# Altium project IMX8SoCIot.PrjPcb (part 8 of 9)

## Sheet ETHERNET.SchDoc
size 594 x 420 mm; SheetNumber: 18; SheetTotal: 20
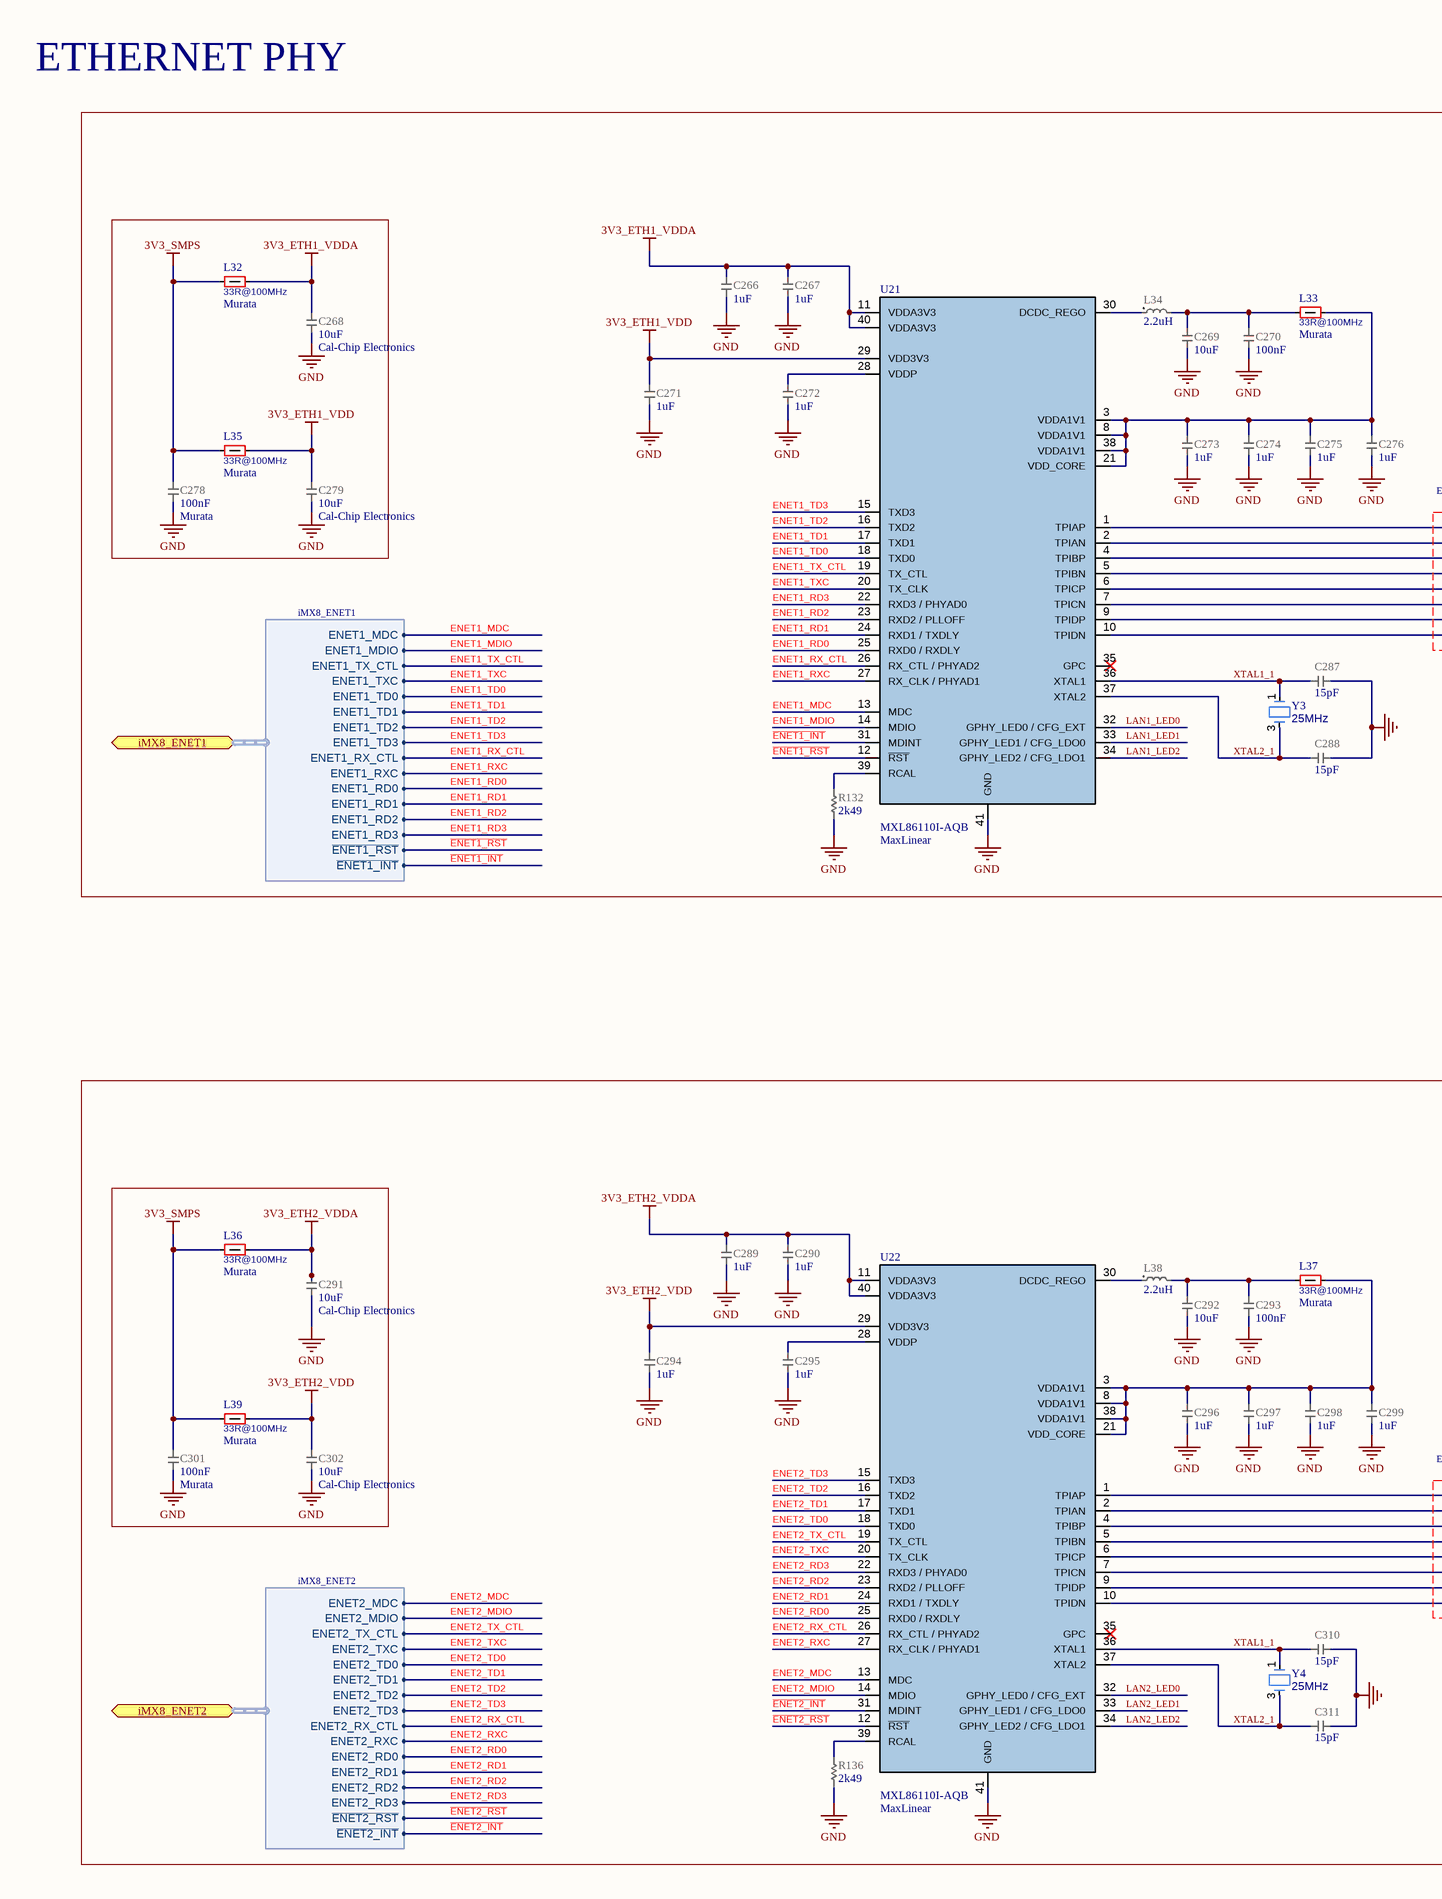
[diagram p29: ETHERNET.SchDoc, left]
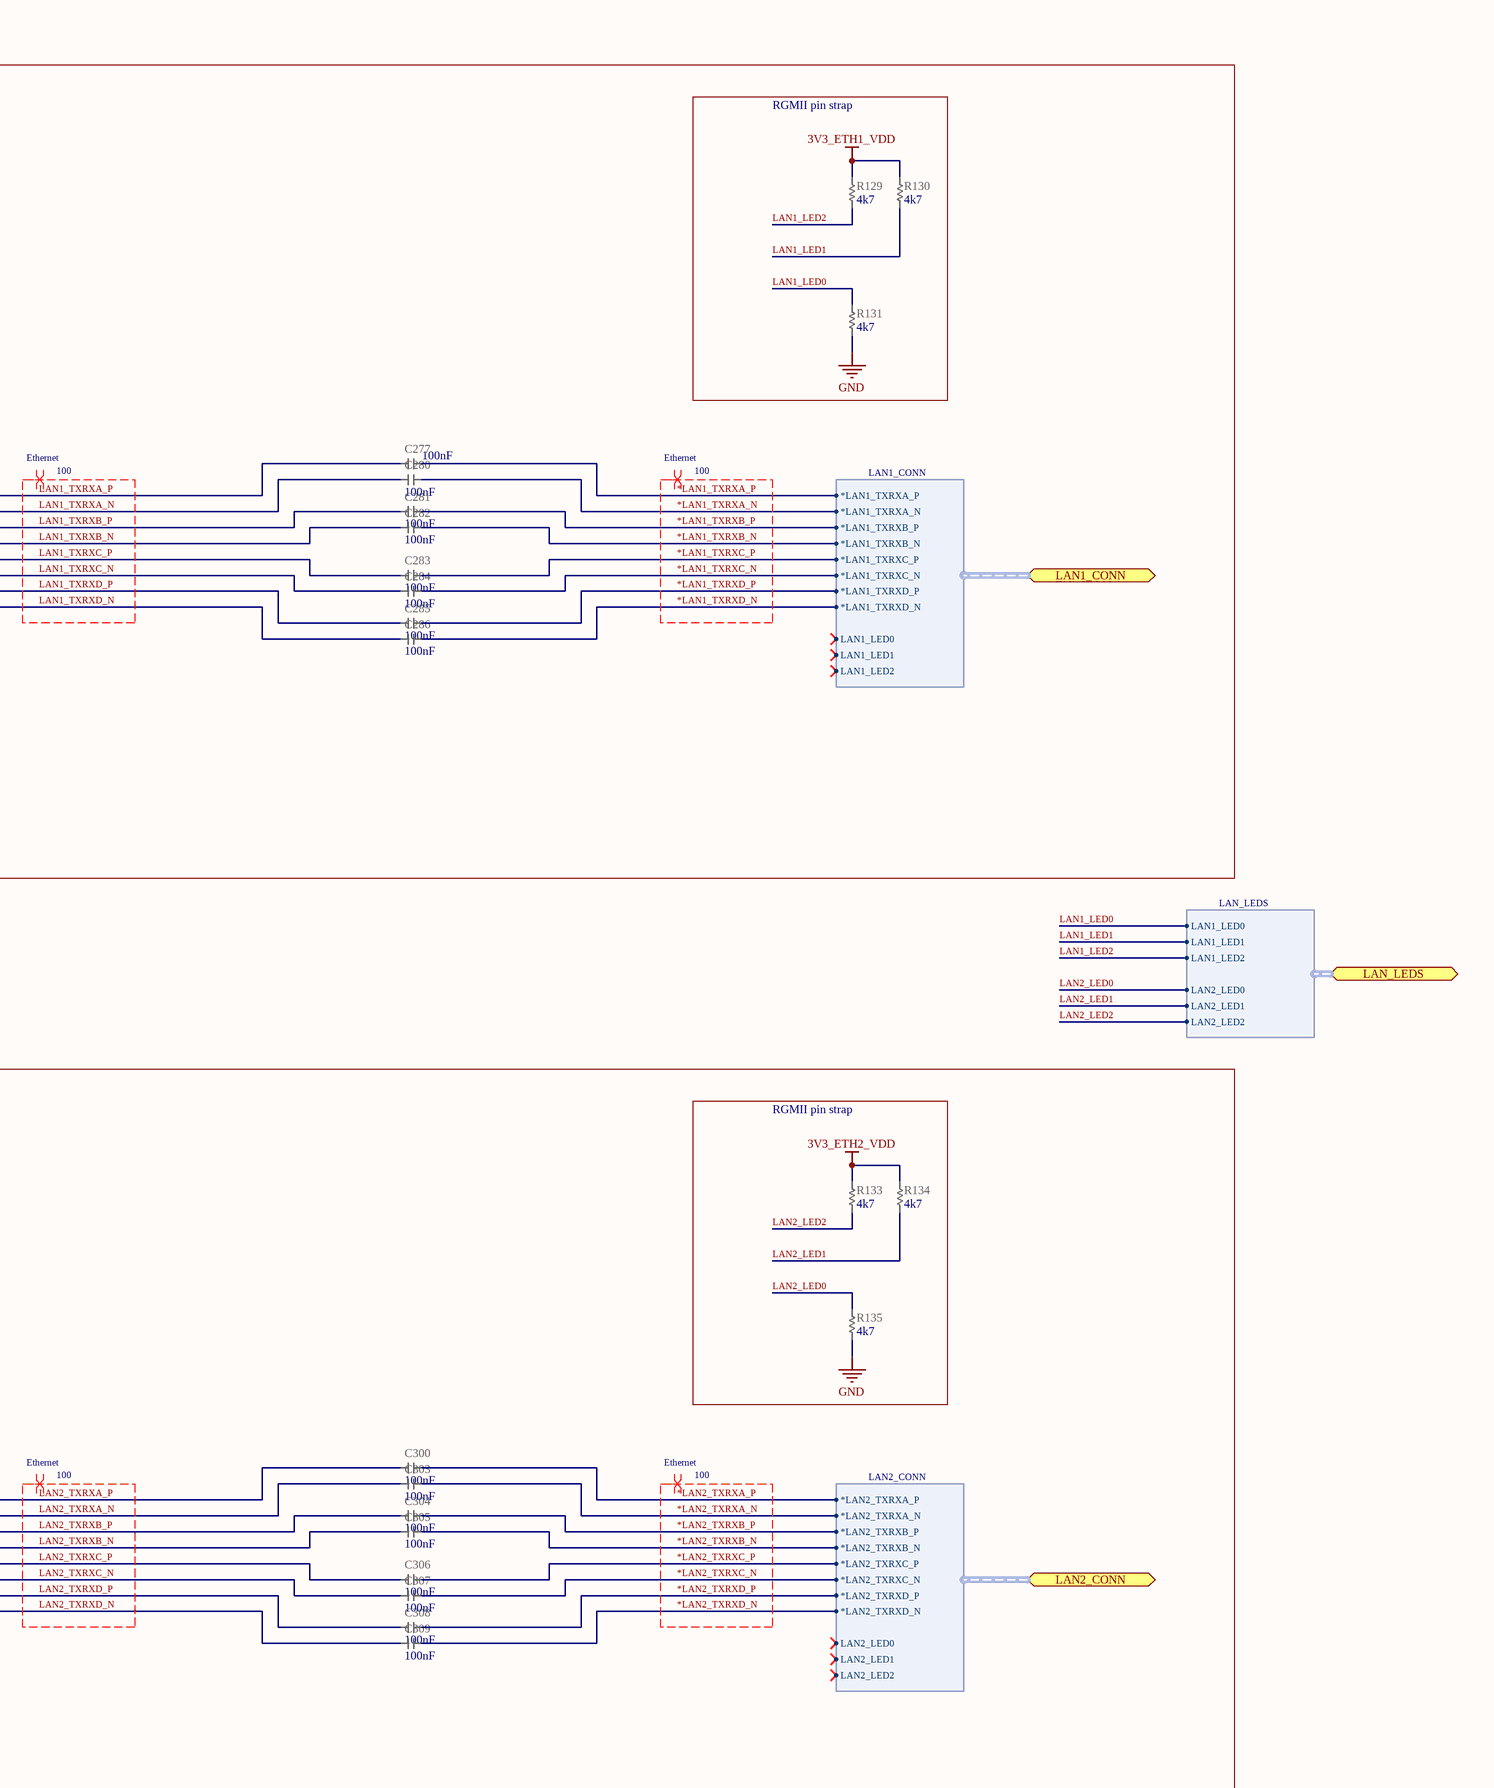
[diagram p30: ETHERNET.SchDoc, right]

### Parts
C266  value 1uF  [CAP_0201_UN1Q]  (hidden comment: CAP_0201_1uF_X6S)
C267  value 1uF  [CAP_0201_UN1Q]  (hidden comment: CAP_0201_1uF_X6S)
C268  value 10uF  Manufacturer: Cal-Chip Electronics  [CAP_0402_H09W07_UN1Q]  (hidden comment: CAP_0402_10u_X6S)
C269  value 10uF  [CAP_0402_H09W07_UN1Q]  (hidden comment: CAP_0402_10u_X6S)
C270  value 100nF  [CAP_0201_UN1Q]  (hidden comment: CAP_0201_100n_X7S_16V)
C271  value 1uF  [CAP_0201_UN1Q]  (hidden comment: CAP_0201_1uF_X6S)
C272  value 1uF  [CAP_0201_UN1Q]  (hidden comment: CAP_0201_1uF_X6S)
C273  value 1uF  [CAP_0201_UN1Q]  (hidden comment: CAP_0201_1uF_X6S)
C274  value 1uF  [CAP_0201_UN1Q]  (hidden comment: CAP_0201_1uF_X6S)
C275  value 1uF  [CAP_0201_UN1Q]  (hidden comment: CAP_0201_1uF_X6S)
C276  value 1uF  [CAP_0201_UN1Q]  (hidden comment: CAP_0201_1uF_X6S)
C277  value 100nF  [CAP_0201_UN1Q]  (hidden comment: CAP_0201_100n_X7S_16V)
C278  value 100nF  Manufacturer: Murata  [CAP_0201_UN1Q]  (hidden comment: CAP_0201_100n_X7S_16V)
C279  value 10uF  Manufacturer: Cal-Chip Electronics  [CAP_0402_H09W07_UN1Q]  (hidden comment: CAP_0402_10u_X6S)
C280  value 100nF  [CAP_0201_UN1Q]  (hidden comment: CAP_0201_100n_X7S_16V)
C281  value 100nF  [CAP_0201_UN1Q]  (hidden comment: CAP_0201_100n_X7S_16V)
C282  value 100nF  [CAP_0201_UN1Q]  (hidden comment: CAP_0201_100n_X7S_16V)
C283  value 100nF  [CAP_0201_UN1Q]  (hidden comment: CAP_0201_100n_X7S_16V)
C284  value 100nF  [CAP_0201_UN1Q]  (hidden comment: CAP_0201_100n_X7S_16V)
C285  value 100nF  [CAP_0201_UN1Q]  (hidden comment: CAP_0201_100n_X7S_16V)
C286  value 100nF  [CAP_0201_UN1Q]  (hidden comment: CAP_0201_100n_X7S_16V)
C287  value 15pF  [CAP_0201_UN1Q]  (hidden comment: CAP_0201_15p)
C288  value 15pF  [CAP_0201_UN1Q]  (hidden comment: CAP_0201_15p)
C289  value 1uF  [CAP_0201_UN1Q]  (hidden comment: CAP_0201_1uF_X6S)
C290  value 1uF  [CAP_0201_UN1Q]  (hidden comment: CAP_0201_1uF_X6S)
C291  value 10uF  Manufacturer: Cal-Chip Electronics  [CAP_0402_H09W07_UN1Q]  (hidden comment: CAP_0402_10u_X6S)
C292  value 10uF  [CAP_0402_H09W07_UN1Q]  (hidden comment: CAP_0402_10u_X6S)
C293  value 100nF  [CAP_0201_UN1Q]  (hidden comment: CAP_0201_100n_X7S_16V)
C294  value 1uF  [CAP_0201_UN1Q]  (hidden comment: CAP_0201_1uF_X6S)
C295  value 1uF  [CAP_0201_UN1Q]  (hidden comment: CAP_0201_1uF_X6S)
C296  value 1uF  [CAP_0201_UN1Q]  (hidden comment: CAP_0201_1uF_X6S)
C297  value 1uF  [CAP_0201_UN1Q]  (hidden comment: CAP_0201_1uF_X6S)
C298  value 1uF  [CAP_0201_UN1Q]  (hidden comment: CAP_0201_1uF_X6S)
C299  value 1uF  [CAP_0201_UN1Q]  (hidden comment: CAP_0201_1uF_X6S)
C300  value 100nF  [CAP_0201_UN1Q]  (hidden comment: CAP_0201_100n_X7S_16V)
C301  value 100nF  Manufacturer: Murata  [CAP_0201_UN1Q]  (hidden comment: CAP_0201_100n_X7S_16V)
C302  value 10uF  Manufacturer: Cal-Chip Electronics  [CAP_0402_H09W07_UN1Q]  (hidden comment: CAP_0402_10u_X6S)
C303  value 100nF  [CAP_0201_UN1Q]  (hidden comment: CAP_0201_100n_X7S_16V)
C304  value 100nF  [CAP_0201_UN1Q]  (hidden comment: CAP_0201_100n_X7S_16V)
C305  value 100nF  [CAP_0201_UN1Q]  (hidden comment: CAP_0201_100n_X7S_16V)
C306  value 100nF  [CAP_0201_UN1Q]  (hidden comment: CAP_0201_100n_X7S_16V)
C307  value 100nF  [CAP_0201_UN1Q]  (hidden comment: CAP_0201_100n_X7S_16V)
C308  value 100nF  [CAP_0201_UN1Q]  (hidden comment: CAP_0201_100n_X7S_16V)
C309  value 100nF  [CAP_0201_UN1Q]  (hidden comment: CAP_0201_100n_X7S_16V)
C310  value 15pF  [CAP_0201_UN1Q]  (hidden comment: CAP_0201_15p)
C311  value 15pF  [CAP_0201_UN1Q]  (hidden comment: CAP_0201_15p)
L32  value 33R@100MHz  Manufacturer: Murata  [IND_0201_UN1Q]  (hidden comment: FERRITE_0201_BLM03_33Ohm)
L33  value 33R@100MHz  Manufacturer: Murata  [IND_0201_UN1Q]  (hidden comment: FERRITE_0201_BLM03_33Ohm)
L34  value 2.2uH  [IND_74479335329222_353220]  (hidden comment: IND_74479335329222_2u2)
L35  value 33R@100MHz  Manufacturer: Murata  [IND_0201_UN1Q]  (hidden comment: FERRITE_0201_BLM03_33Ohm)
L36  value 33R@100MHz  Manufacturer: Murata  [IND_0201_UN1Q]  (hidden comment: FERRITE_0201_BLM03_33Ohm)
L37  value 33R@100MHz  Manufacturer: Murata  [IND_0201_UN1Q]  (hidden comment: FERRITE_0201_BLM03_33Ohm)
L38  value 2.2uH  [IND_74479335329222_353220]  (hidden comment: IND_74479335329222_2u2)
L39  value 33R@100MHz  Manufacturer: Murata  [IND_0201_UN1Q]  (hidden comment: FERRITE_0201_BLM03_33Ohm)
R129  value 4k7  [RES_0201_UN1Q]  (hidden comment: RES_0201_4k7)
R130  value 4k7  [RES_0201_UN1Q]  (hidden comment: RES_0201_4k7)
R131  value 4k7  [RES_0201_UN1Q]  (hidden comment: RES_0201_4k7)
R132  value 2k49  [RES_0201_UN1Q]  (hidden comment: RES_0201_2k49)
R133  value 4k7  [RES_0201_UN1Q]  (hidden comment: RES_0201_4k7)
R134  value 4k7  [RES_0201_UN1Q]  (hidden comment: RES_0201_4k7)
R135  value 4k7  [RES_0201_UN1Q]  (hidden comment: RES_0201_4k7)
R136  value 2k49  [RES_0201_UN1Q]  (hidden comment: RES_0201_2k49)
U21  Manufacturer: MaxLinear  [QFN40_5x5mm]  (hidden comment: MXL86110I-AQB)
U22  Manufacturer: MaxLinear  [QFN40_5x5mm]  (hidden comment: MXL86110I-AQB)
Y3  value 25MHz  [XTAL_2016_UN1Q]  (hidden comment: XTAL_25M_ECS_2016_4-SMD)
Y4  value 25MHz  [XTAL_2016_UN1Q]  (hidden comment: XTAL_25M_ECS_2016_4-SMD)

### Blocks framed on the sheet
RGMII pin strap: R129-R131
RGMII pin strap: R133-R135

### Ports
iMX8_ENET1 (bidir, harness iMX8_ENET1), iMX8_ENET2 (bidir, harness iMX8_ENET2), LAN1_CONN (bidir, harness LAN1_CONN), LAN2_CONN (bidir, harness LAN2_CONN), LAN_LEDS (bidir, harness LAN_LEDS)

### Harnesses
iMX8_ENET1: ENET1_MDC, ENET1_MDIO, ENET1_TX_CTL, ENET1_TXC, ENET1_TD0, ENET1_TD1, ENET1_TD2, ENET1_TD3, ENET1_RX_CTL, ENET1_RXC, ENET1_RD0, ENET1_RD1, ENET1_RD2, ENET1_RD3, ~{ENET1_RST}, ~{ENET1_INT}
iMX8_ENET2: ENET2_MDC, ENET2_MDIO, ENET2_TX_CTL, ENET2_TXC, ENET2_TD0, ENET2_TD1, ENET2_TD2, ENET2_TD3, ENET2_RX_CTL, ENET2_RXC, ENET2_RD0, ENET2_RD1, ENET2_RD2, ENET2_RD3, ~{ENET2_RST}, ~{ENET2_INT}
LAN1_CONN: LAN1_LED0, LAN1_LED1, LAN1_LED2, *LAN1_TXRXA_P, *LAN1_TXRXA_N, *LAN1_TXRXB_P, *LAN1_TXRXB_N, *LAN1_TXRXC_P, *LAN1_TXRXC_N, *LAN1_TXRXD_P, *LAN1_TXRXD_N
LAN2_CONN: LAN2_LED0, LAN2_LED1, LAN2_LED2, *LAN2_TXRXA_P, *LAN2_TXRXA_N, *LAN2_TXRXB_P, *LAN2_TXRXB_N, *LAN2_TXRXC_P, *LAN2_TXRXC_N, *LAN2_TXRXD_P, *LAN2_TXRXD_N
LAN_LEDS: LAN1_LED0, LAN1_LED1, LAN1_LED2, LAN2_LED0, LAN2_LED1, LAN2_LED2

### Nets
3V3_ETH1_VDD: C271.2 C279.2 L35.2 R129.2 R130.2 U21.29(VDD3V3)
3V3_ETH1_VDDA: C266.2 C267.2 C268.2 L32.2 U21.11(VDDA3V3) U21.40(VDDA3V3)
3V3_ETH2_VDD: C294.2 C302.2 L39.2 R133.2 R134.2 U22.29(VDD3V3)
3V3_ETH2_VDDA: C289.2 C290.2 C291.2 L36.2 U22.11(VDDA3V3) U22.40(VDDA3V3)
3V3_SMPS: C278.2 C301.2 L32.1 L35.1 L36.1 L39.1
GND: C266.1 C267.1 C268.1 C269.2 C270.1 C271.1 C272.1 C273.1 C274.1 C275.1 C276.1 C278.1 C279.1 C287.2 C288.2 C289.1 C290.1 C291.1 C292.2 C293.1 C294.1 C295.1 C296.1 C297.1 C298.1 C299.1 C301.1 C302.1 C310.2 C311.2 R131.1 R132.1 R135.1 R136.1 U21.41(GND) U22.41(GND) Y3.2(GND) Y3.4(GND) Y4.2(GND) Y4.4(GND)
*LAN1_TXRXA_N: C280.2 ; port LAN1_CONN.*LAN1_TXRXA_N
*LAN1_TXRXA_P: C277.2 ; port LAN1_CONN.*LAN1_TXRXA_P
*LAN1_TXRXB_N: C282.2 ; port LAN1_CONN.*LAN1_TXRXB_N
*LAN1_TXRXB_P: C281.2 ; port LAN1_CONN.*LAN1_TXRXB_P
*LAN1_TXRXC_N: C284.2 ; port LAN1_CONN.*LAN1_TXRXC_N
*LAN1_TXRXC_P: C283.2 ; port LAN1_CONN.*LAN1_TXRXC_P
*LAN1_TXRXD_N: C286.2 ; port LAN1_CONN.*LAN1_TXRXD_N
*LAN1_TXRXD_P: C285.2 ; port LAN1_CONN.*LAN1_TXRXD_P
*LAN2_TXRXA_N: C303.2 ; port LAN2_CONN.*LAN2_TXRXA_N
*LAN2_TXRXA_P: C300.2 ; port LAN2_CONN.*LAN2_TXRXA_P
*LAN2_TXRXB_N: C305.2 ; port LAN2_CONN.*LAN2_TXRXB_N
*LAN2_TXRXB_P: C304.2 ; port LAN2_CONN.*LAN2_TXRXB_P
*LAN2_TXRXC_N: C307.2 ; port LAN2_CONN.*LAN2_TXRXC_N
*LAN2_TXRXC_P: C306.2 ; port LAN2_CONN.*LAN2_TXRXC_P
*LAN2_TXRXD_N: C309.2 ; port LAN2_CONN.*LAN2_TXRXD_N
*LAN2_TXRXD_P: C308.2 ; port LAN2_CONN.*LAN2_TXRXD_P
~{ENET1_INT}: U21.31(MDINT) ; port iMX8_ENET1.~{ENET1_INT}
~{ENET1_RST}: U21.12(~{RST}) ; port iMX8_ENET1.~{ENET1_RST}
~{ENET2_INT}: U22.31(MDINT) ; port iMX8_ENET2.~{ENET2_INT}
~{ENET2_RST}: U22.12(~{RST}) ; port iMX8_ENET2.~{ENET2_RST}
ENET1_MDC: U21.13(MDC) ; port iMX8_ENET1.ENET1_MDC
ENET1_MDIO: U21.14(MDIO) ; port iMX8_ENET1.ENET1_MDIO
ENET1_RD0: U21.25(RXD0_/_RXDLY) ; port iMX8_ENET1.ENET1_RD0
ENET1_RD1: U21.24(RXD1_/_TXDLY) ; port iMX8_ENET1.ENET1_RD1
ENET1_RD2: U21.23(RXD2_/_PLLOFF) ; port iMX8_ENET1.ENET1_RD2
ENET1_RD3: U21.22(RXD3_/_PHYAD0) ; port iMX8_ENET1.ENET1_RD3
ENET1_RX_CTL: U21.26(RX_CTL_/_PHYAD2) ; port iMX8_ENET1.ENET1_RX_CTL
ENET1_RXC: U21.27(RX_CLK_/_PHYAD1) ; port iMX8_ENET1.ENET1_RXC
ENET1_TD0: U21.18(TXD0) ; port iMX8_ENET1.ENET1_TD0
ENET1_TD1: U21.17(TXD1) ; port iMX8_ENET1.ENET1_TD1
ENET1_TD2: U21.16(TXD2) ; port iMX8_ENET1.ENET1_TD2
ENET1_TD3: U21.15(TXD3) ; port iMX8_ENET1.ENET1_TD3
ENET1_TX_CTL: U21.19(TX_CTL) ; port iMX8_ENET1.ENET1_TX_CTL
ENET1_TXC: U21.20(TX_CLK) ; port iMX8_ENET1.ENET1_TXC
ENET2_MDC: U22.13(MDC) ; port iMX8_ENET2.ENET2_MDC
ENET2_MDIO: U22.14(MDIO) ; port iMX8_ENET2.ENET2_MDIO
ENET2_RD0: U22.25(RXD0_/_RXDLY) ; port iMX8_ENET2.ENET2_RD0
ENET2_RD1: U22.24(RXD1_/_TXDLY) ; port iMX8_ENET2.ENET2_RD1
ENET2_RD2: U22.23(RXD2_/_PLLOFF) ; port iMX8_ENET2.ENET2_RD2
ENET2_RD3: U22.22(RXD3_/_PHYAD0) ; port iMX8_ENET2.ENET2_RD3
ENET2_RX_CTL: U22.26(RX_CTL_/_PHYAD2) ; port iMX8_ENET2.ENET2_RX_CTL
ENET2_RXC: U22.27(RX_CLK_/_PHYAD1) ; port iMX8_ENET2.ENET2_RXC
ENET2_TD0: U22.18(TXD0) ; port iMX8_ENET2.ENET2_TD0
ENET2_TD1: U22.17(TXD1) ; port iMX8_ENET2.ENET2_TD1
ENET2_TD2: U22.16(TXD2) ; port iMX8_ENET2.ENET2_TD2
ENET2_TD3: U22.15(TXD3) ; port iMX8_ENET2.ENET2_TD3
ENET2_TX_CTL: U22.19(TX_CTL) ; port iMX8_ENET2.ENET2_TX_CTL
ENET2_TXC: U22.20(TX_CLK) ; port iMX8_ENET2.ENET2_TXC
LAN1_LED0: R131.2 U21.32(GPHY_LED0_/_CFG_EXT) ; port LAN_LEDS.LAN1_LED0
LAN1_LED1: R130.1 U21.33(GPHY_LED1_/_CFG_LDO0) ; port LAN_LEDS.LAN1_LED1
LAN1_LED2: R129.1 U21.34(GPHY_LED2_/_CFG_LDO1) ; port LAN_LEDS.LAN1_LED2
LAN1_TXRXA_N: C280.1 U21.2(TPIAN)
LAN1_TXRXA_P: C277.1 U21.1(TPIAP)
LAN1_TXRXB_N: C282.1 U21.5(TPIBN)
LAN1_TXRXB_P: C281.1 U21.4(TPIBP)
LAN1_TXRXC_N: C284.1 U21.7(TPICN)
LAN1_TXRXC_P: C283.1 U21.6(TPICP)
LAN1_TXRXD_N: C286.1 U21.10(TPIDN)
LAN1_TXRXD_P: C285.1 U21.9(TPIDP)
LAN2_LED0: R135.2 U22.32(GPHY_LED0_/_CFG_EXT) ; port LAN_LEDS.LAN2_LED0
LAN2_LED1: R134.1 U22.33(GPHY_LED1_/_CFG_LDO0) ; port LAN_LEDS.LAN2_LED1
LAN2_LED2: R133.1 U22.34(GPHY_LED2_/_CFG_LDO1) ; port LAN_LEDS.LAN2_LED2
LAN2_TXRXA_N: C303.1 U22.2(TPIAN)
LAN2_TXRXA_P: C300.1 U22.1(TPIAP)
LAN2_TXRXB_N: C305.1 U22.5(TPIBN)
LAN2_TXRXB_P: C304.1 U22.4(TPIBP)
LAN2_TXRXC_N: C307.1 U22.7(TPICN)
LAN2_TXRXC_P: C306.1 U22.6(TPICP)
LAN2_TXRXD_N: C309.1 U22.10(TPIDN)
LAN2_TXRXD_P: C308.1 U22.9(TPIDP)
XTAL1_1: C287.1 C310.1 U21.36(XTAL1) U22.36(XTAL1) Y3.1 Y4.1
XTAL2_1: C288.1 C311.1 U21.37(XTAL2) U22.37(XTAL2) Y3.3 Y4.3
NetC269_1: C269.1 C270.2 L33.1 L34.2
NetC272_2: C272.2 U21.28(VDDP)
NetC273_2: C273.2 C274.2 C275.2 C276.2 L33.2 U21.3(VDDA1V1) U21.8(VDDA1V1) U21.21(VDD_CORE) U21.38(VDDA1V1)
NetC292_1: C292.1 C293.2 L37.1 L38.2
NetC295_2: C295.2 U22.28(VDDP)
NetC296_2: C296.2 C297.2 C298.2 C299.2 L37.2 U22.3(VDDA1V1) U22.8(VDDA1V1) U22.21(VDD_CORE) U22.38(VDDA1V1)
NetL34_1: L34.1 U21.30(DCDC_REGO)
NetL38_1: L38.1 U22.30(DCDC_REGO)
NetR132_2: R132.2 U21.39(RCAL)
NetR136_2: R136.2 U22.39(RCAL)

Not connected (* = marked no-connect by the designer): U21 35(GPC)*; U22 35(GPC)*

### Layout directives
differential pair; net class Ethernet; differential pair class 100; rule Matched Net Lengths [Tolerance = 0.4mm]: *LAN1_TXRXA_N, *LAN1_TXRXA_P, *LAN1_TXRXB_N, *LAN1_TXRXB_P, *LAN1_TXRXC_N, *LAN1_TXRXC_P, *LAN1_TXRXD_N, *LAN1_TXRXD_P, *LAN2_TXRXA_N, *LAN2_TXRXA_P, *LAN2_TXRXB_N, *LAN2_TXRXB_P, *LAN2_TXRXC_N, *LAN2_TXRXC_P, *LAN2_TXRXD_N, *LAN2_TXRXD_P, LAN1_TXRXA_N, LAN1_TXRXA_P, LAN1_TXRXB_N, LAN1_TXRXB_P, LAN1_TXRXC_N, LAN1_TXRXC_P, LAN1_TXRXD_N, LAN1_TXRXD_P, LAN2_TXRXA_N, LAN2_TXRXA_P, LAN2_TXRXB_N, LAN2_TXRXB_P, LAN2_TXRXC_N, LAN2_TXRXC_P, LAN2_TXRXD_N, LAN2_TXRXD_P

### Notes on the sheet
- ETHERNET PHY
- DWG NO:
- REV:
- THIS DOCUMENT AND THE DATA DISCLOSED HEREIN OR
- HEREWITH IS THE PROPERTY OF ALTIUM LIMITED AND MAY
- BE FREELY DISTRIBUTED IN WHOLE. NO RIGHTS ARE
- RESERVED OR EXPRESS OR IMPLIED WARANTEE GIVEN.
- REVISION
- DESCRIPTION
- DATE
- APPROVED
- ENG:
- APPROVALS
- PROJECT
- DSN:
- CHK:
- REFERENCE DOCUMENTS
- PROJECT REVISION:
- TITLE
- DOCUMENT REVISION:
- DESIGN ITEM:
- BOM:
- FAB DWG:
- PCB DWG:
- ASSY DWG:
- SCALE:
- A2
- SIZE
- CAGE CODE
- FILE NAME
- DWG NO.
- SHEET
- OF
- REV

### Library data of the parts
C266 C267 C271-C276 C289 C290 C294-C299 = CMP-001-000336-15: as C251 on sheet USB_PER2; Package: 0201; Operating temperature range: -55C to +105C; ComponentLink1Description: 1_Datasheet; ComponentLink2Description: 2_Product page; ComponentLink3Description: 3_X-information; ComponentLink4Description: 4_X-information; Creation date: 20190101; ClassName: SMALL; Source: RLC_UN1Q.SchLib; Manufacturer Part Number: KGM03CS61A105MH; Component Type: Capacitor
C268 C279 C291 C302 = CMP-001-000883-14: CAP; Part Number: GMC04X6S106M6R3NT; Manufacturer: Cal-Chip Electronics, Inc.; Temperature characteristics: X6S; Voltage: 6.3V; Tolerance: +/-20%; Sort order: 304; HasBeenBuilt: TBD; Alternative component: Allowed; System: RLC; Package: 0402; ComponentLink1Description: 1_Datasheet; ComponentLink2Description: 2_Product page; ComponentLink3Description: 3_X-information; ComponentLink4Description: 4_X-information; Creation date: 26042024; Manufacturer Part Number: GMC04X6S106M6R3NT; Component Type: Capacitor
C269 C292 = CMP-001-000883-14: CAP; Part Number: GMC04X6S106M6R3NT; Manufacturer: Cal-Chip Electronics, Inc.; Manufacturer: Cal-Chip Electronics; Temperature characteristics: X6S; Voltage: 6.3V; Tolerance: +/-20%; Sort order: 304; HasBeenBuilt: TBD; Alternative component: Allowed; System: RLC; Package: 0402; ComponentLink1Description: 1_Datasheet; ComponentLink2Description: 2_Product page; ComponentLink3Description: 3_X-information; ComponentLink4Description: 4_X-information; Creation date: 26042024; Manufacturer Part Number: GMC04X6S106M6R3NT; Component Type: Capacitor
C270 C277 C280-C286 C293 C300 C303-C309 = CMP-001-000385-16: as C250 on sheet USB_PER2; Package: 0201; ClassName: SMALL; ComponentLink1Description: 1_Datasheet; ComponentLink2Description: 2_Product page; ComponentLink3Description: 3_X-information; ComponentLink4Description: 4_X-information; Creation date: 20190101; Source: RLC_UN1Q.SchLib; Manufacturer Part Number: GRM033C71C104KE14D; Component Type: Capacitor
C278 C301 = CMP-001-000385-16: CAP; Part Number: GRM033C71C104KE14D; Temperature characteristics: X7S; Tolerance: +/-10%; Sort order: 302; HasBeenBuilt: TBD; Alternative component: Allowed; Voltage: 16V; System: RLC; Package: 0201; ClassName: SMALL; ComponentLink1Description: 1_Datasheet; ComponentLink2Description: 2_Product page; ComponentLink3Description: 3_X-information; ComponentLink4Description: 4_X-information; Creation date: 20190101; Source: RLC_UN1Q.SchLib; Manufacturer Part Number: GRM033C71C104KE14D; Component Type: Capacitor
C287 C288 C310 C311 = CMP-001-000269-15: CAP; Part Number: GRM0335C1H150JA01D; Manufacturer: Murata; Temperature characteristics: C0G; Voltage: 50V; Tolerance: +/-5%; Sort order: 302; HasBeenBuilt: TBD; Alternative component: Allowed; System: RLC; Package: 0201; ComponentLink1Description: 1_Datasheet; ComponentLink2Description: 2_Product page; ComponentLink3Description: 3_X-information; ComponentLink4Description: 4_X-information; Creation date: 20190101; ClassName: SMALL; Source: RLC_UN1Q.SchLib; Manufacturer Part Number: GRM0335C1H150JA01D; Component Type: Capacitor
L32 L33 L35-L37 L39 = CMP-001-000744-8: FERRITE; Part Number: BLM03PG330SN1; Manufacturer Part Number: BLM03PG330SN1D; Tolerance: 25%; Sort order: 362; HasBeenBuilt: TBD; System: Discrete; Current: 750mA; Package: 0201; Operating temperature range: -55 ... +125C; ClassName: SMALL; ComponentLink1Description: 1_Datasheet; ComponentLink1URL: https://www.murata.com/en-us/products/productdetail.aspx?cate=luNoiseSupprFilteChipFerriBead&partno=BLM03PG330SN1%23; ComponentLink2Description: 2_Product page; ComponentLink3Description: 3_X-information; ComponentLink4Description: 4_X-information; Creation date: 20200304; Source: Discrete_UN1Q.SchLib; Component Type: Ferrite
L34 L38 = CMP-001-001617-1: IND, Low DCR, shielded.; Manufacturer: Wurth; Manufacturer: Wurth Elektronik; Manufacturer Part Number: 74439334047; Sort order: 348; System: RLC; Package: 353220; Dimensions WxLxH: 3.5 x 3.2 x 2.0mm; Part Number: 74479335329222; ComponentLink1Description: 1_Datasheet; ComponentLink1URL: https://www.we-online.com/components/products/datasheet/74479335329222.pdf; ComponentLink2Description: 2_Product_page; ComponentLink2URL: https://www.we-online.com/en/components/products/WE-PMFI#74479335329222; Creation date: 20251029; Operating temperature range: -55°C ~ 150°C; ClassName: BIG; ComponentLink3Description: 3_X-information; ComponentLink4Description: 4_X-information; Component Type: Inductor
R129-R131 R133-R135 = CMP-001-000475-13: RES; Part Number: RC0201FR-074K7L; Manufacturer: YAGEO; Manufacturer: Yageo Group; Power Rating: 1/20W; Sort order: 322; HasBeenBuilt: TBD; Alternative component: Allowed; Tolerance: 1%; System: RLC; Package: 0201; ClassName: SMALL; ComponentLink1Description: 1_Datasheet; ComponentLink2Description: 2_Product page; ComponentLink3Description: 3_X-information; ComponentLink4Description: 4_X-information; Creation date: 20190101; Source: RLC_UN1Q.SchLib; Manufacturer Part Number: RC0201FR-074K7L; Component Type: Resistor
R132 R136 = CMP-001-000561-13: RES; Part Number: RMCF0201FT2K49; Manufacturer: YAGEO; Power Rating: 1/20W; Sort order: 322; HasBeenBuilt: TBD; Alternative component: Allowed; Tolerance: 1%; System: RLC; Package: 0201; ClassName: SMALL; ComponentLink1Description: 1_Datasheet; ComponentLink2Description: 2_Product page; ComponentLink3Description: 3_X-information; ComponentLink4Description: 4_X-information; Creation date: 20230510; Source: RLC_UN1Q.SchLib; Component Type: Resistor
U21 U22 = CMP-031-000173-6: Ethernet PHY, RGMII, 1000BASE-T, 100BASE-TX, 10BASE-Te; Sort order: 501; HasBeenBuilt: False; System: IC; Package: QFN40; Operating temperature range: -40 .... +85 °C; ClassName: BIG; Creation Date: 26032024; ComponentLink1Description: 1_Datasheet; ComponentLink1URL: https://www.maxlinear.com/Document/index?id=23355&productId=14849; ComponentLink2Description: 2_Product_page; ComponentLink2URL: https://www.maxlinear.com/product/interface/ethernet/ethernet-transceivers-phy/mxl86110; ComponentLink3Description: 3_X-information; ComponentLink4Description: 4_X-information; Dimensions WxLxH: 5x5x1mm; Part Number: MXL86110I-AQB; Source: UUDET_KOMPONENTIT.SchLib; Design Item ID: MXL86110I-AQB; Manufacturer Part Number: MXL86110I-AQB; Component Type: Data Converter
Y3 Y4 = CMP-001-000909-8: Crystal 25MHz ±10ppm, 10pF; Part Number: ECS-250-10-37B-CTN; Manufacturer: ECS Inc.; Manufacturer: ECS International; Manufacturer Part Number: ECS-250-10-37B-CTN-TR; Tolerance: +/-10ppm; Sort order: 455; HasBeenBuilt: Cmod2_01; System: Discrete; Operating temperature range: -40 ... +85C; Dimensions WxLxH: 2 x 1.6mm x 0.65mm; Creation date: 20230102; ComponentLink1Description: 1_Datasheet; ComponentLink1URL: https://ecsxtal.com/store/pdf/ECX-1637B.pdf; ComponentLink2Description: 2_Product_page; ComponentLink2URL: https://ecsxtal.com/products/crystals/surface-mount-crystals/ecx-1637b/; ComponentLink3Description: 3_X-information; ComponentLink4Description: 4_X-information; ECCN: EAR99; Source: UUDET_KOMPONENTIT.SchLib; RoHS: RoHS3; Component Type: Crystal & Oscillator

## Sheet SYSTEM_INTERFACE.SchDoc
size 594 x 420 mm; SheetNumber: 19; SheetTotal: 20
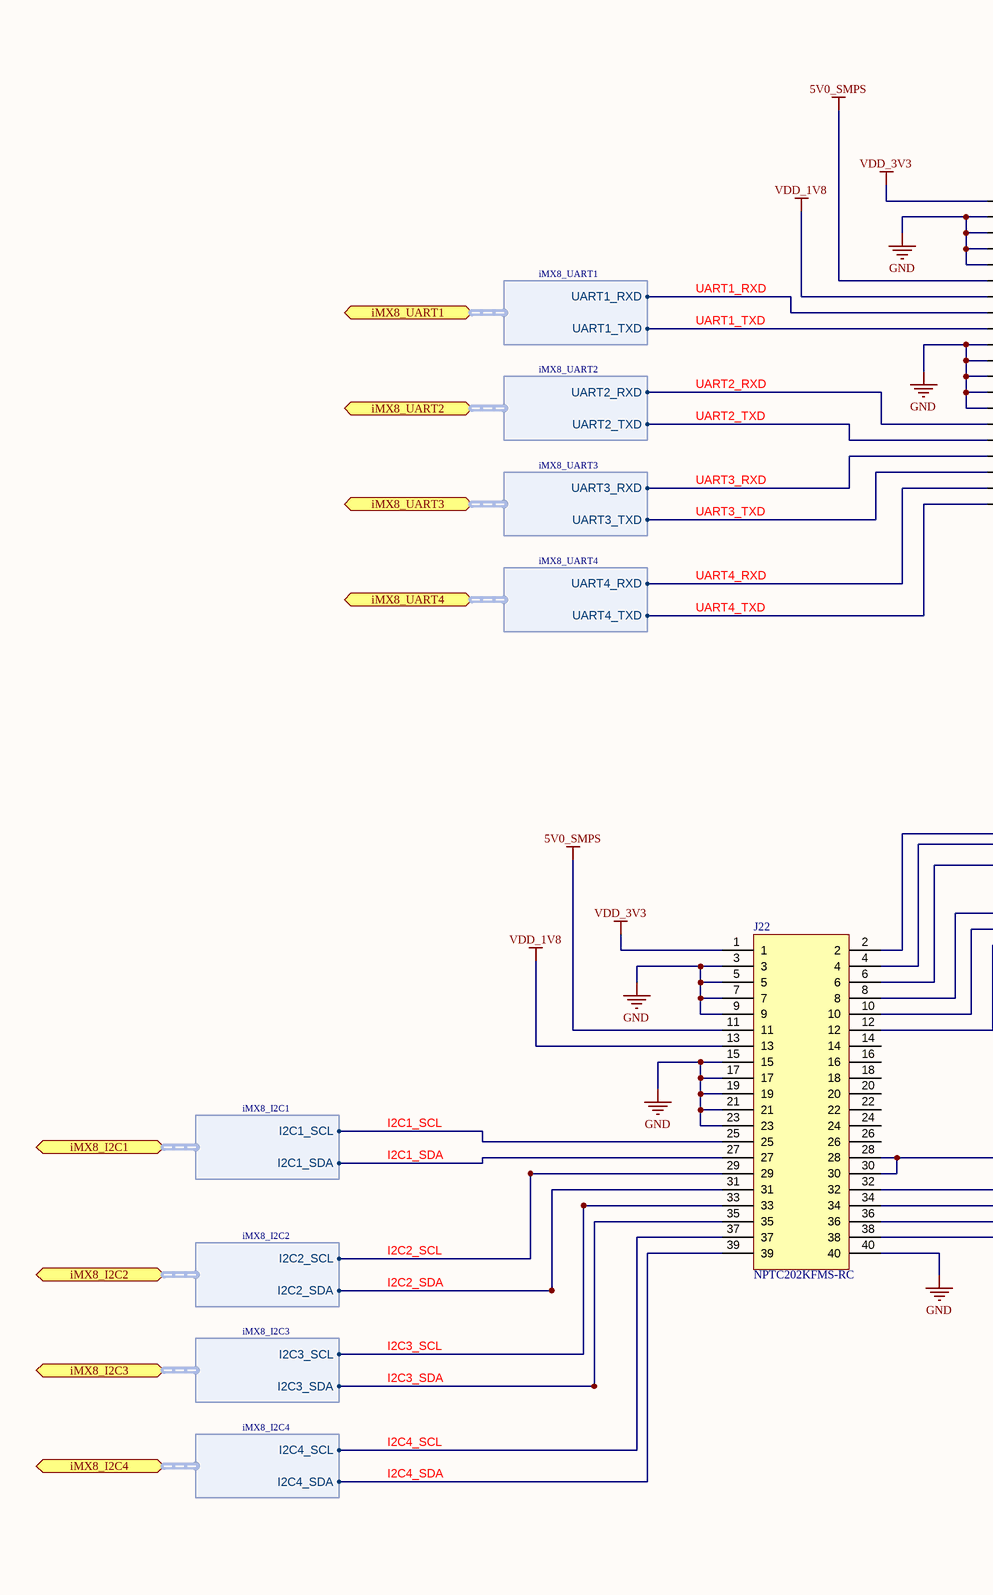
[diagram p31: SYSTEM_INTERFACE.SchDoc, left]
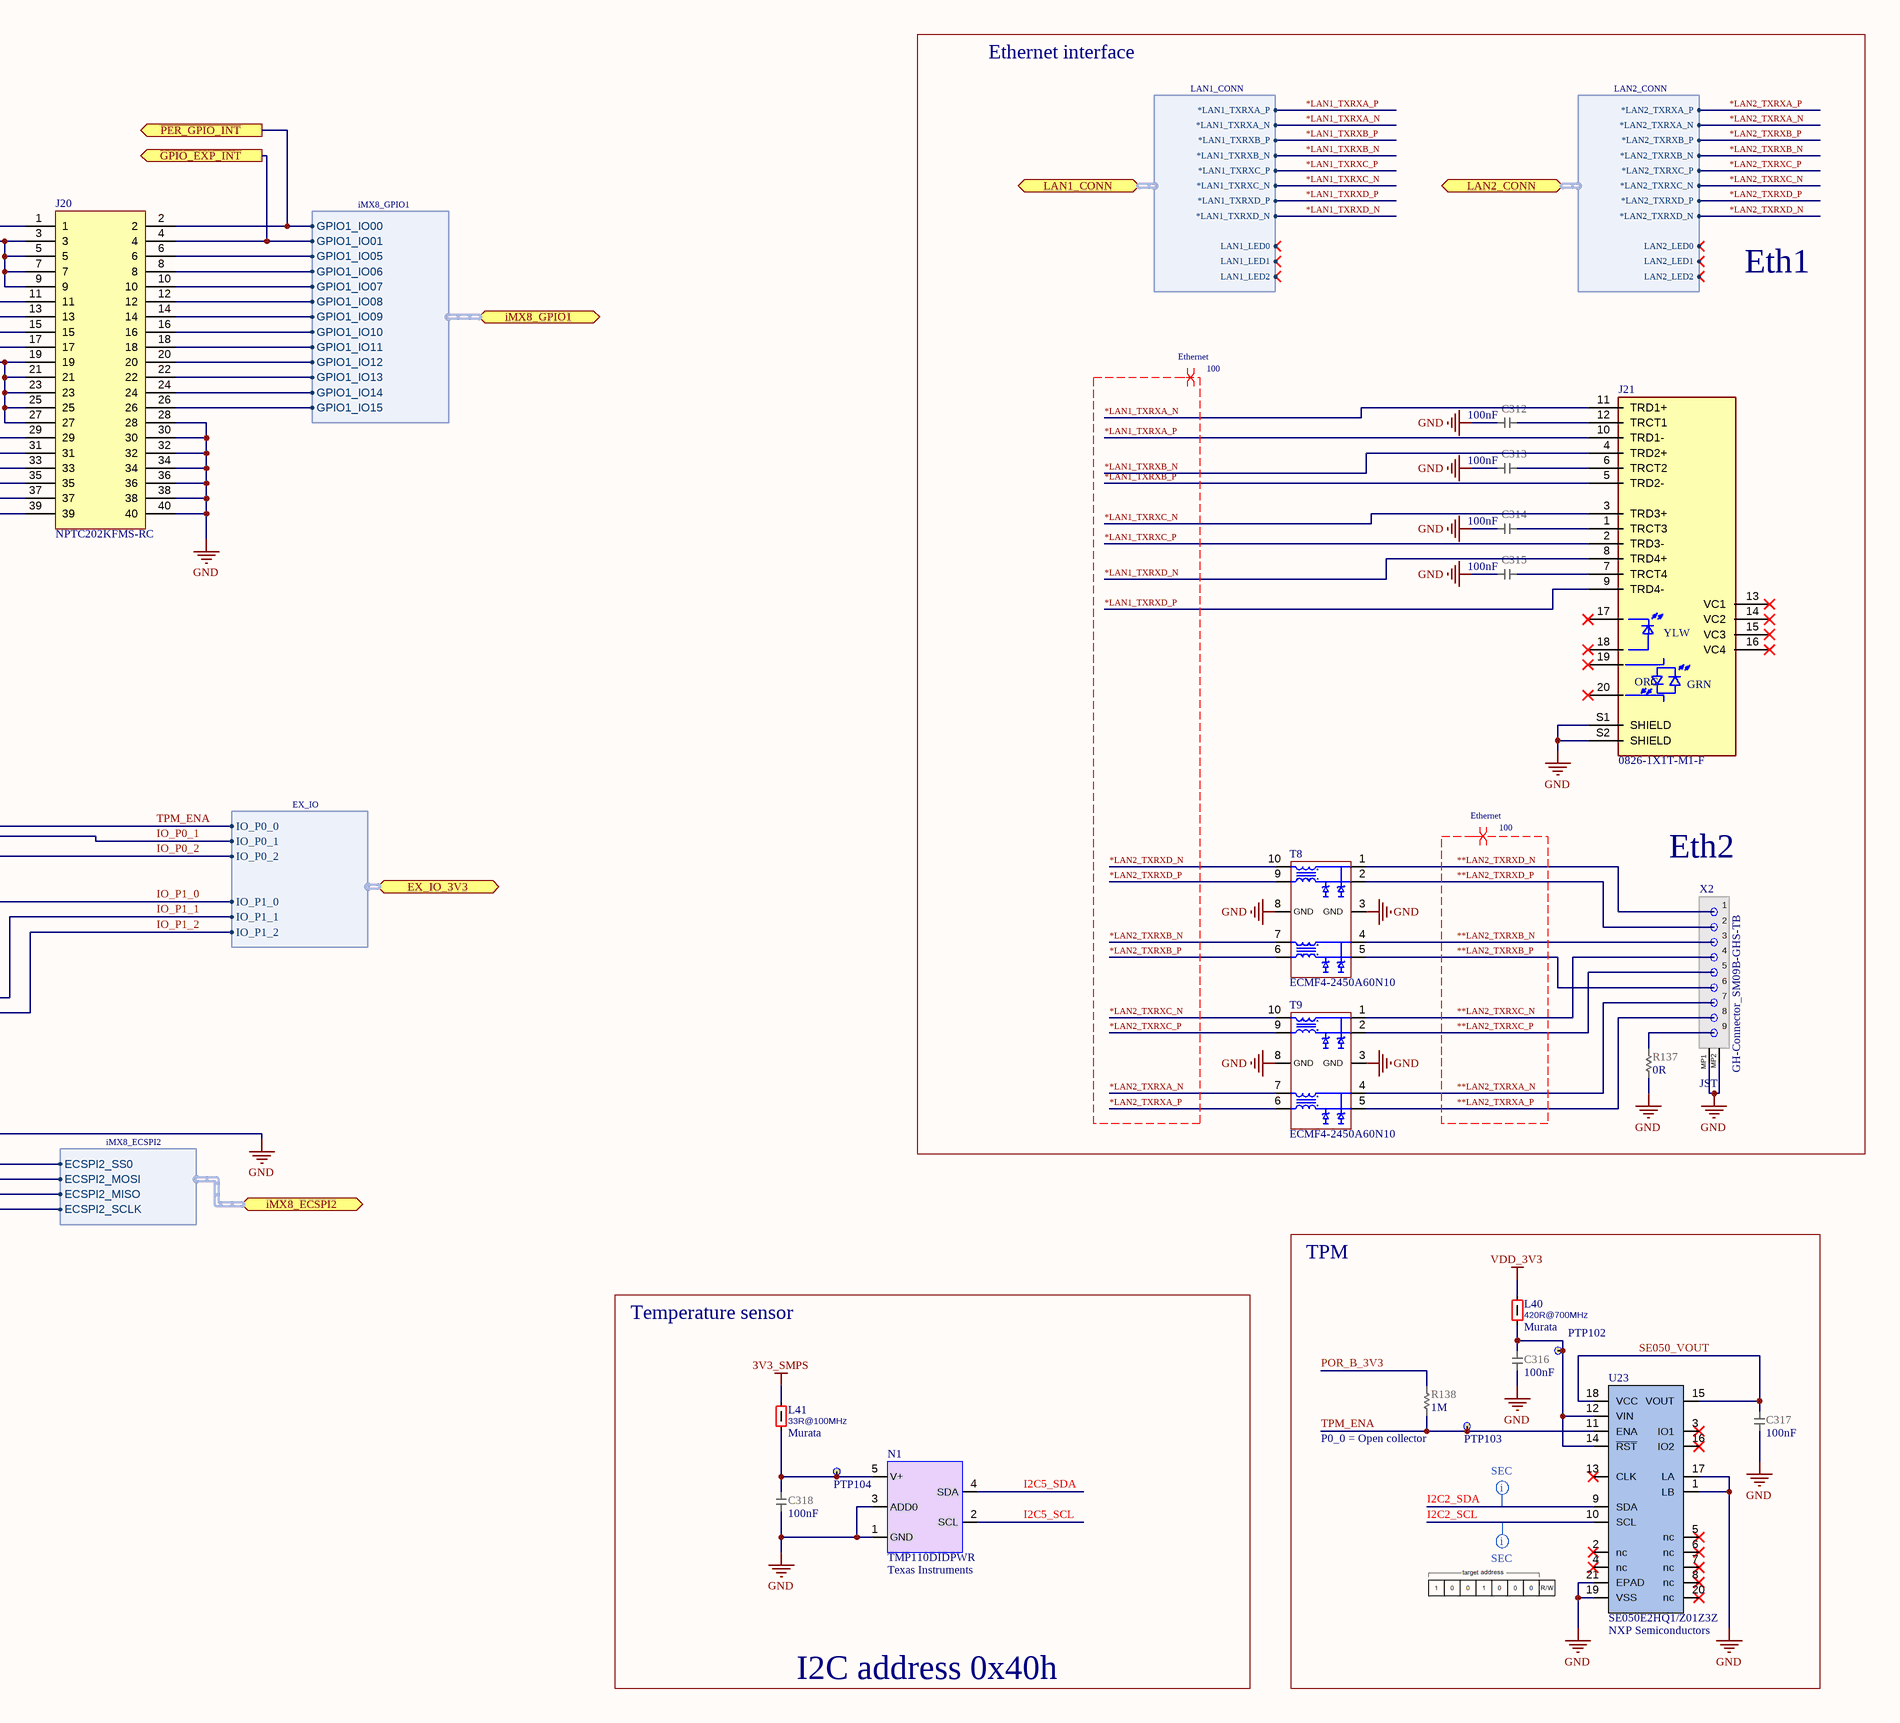
[diagram p32: SYSTEM_INTERFACE.SchDoc, right]

### Parts
C312  value 100nF  [CAP_0201_UN1Q]  (hidden comment: CAP_0201_100n_X7S_16V)
C313  value 100nF  [CAP_0201_UN1Q]  (hidden comment: CAP_0201_100n_X7S_16V)
C314  value 100nF  [CAP_0201_UN1Q]  (hidden comment: CAP_0201_100n_X7S_16V)
C315  value 100nF  [CAP_0201_UN1Q]  (hidden comment: CAP_0201_100n_X7S_16V)
C316  value 100nF  [CAP_0201_UN1Q]  (hidden comment: CAP_0201_100n_X7S_16V)
C317  value 100nF  [CAP_0201_UN1Q]  (hidden comment: CAP_0201_100n_X7S_16V)
C318  value 100nF  [CAP_0201_UN1Q]  (hidden comment: CAP_0201_100n_X7S_16V)
J20  NPTC202KFMS-RC  [SULLINS_NPTC202KFMS-RC]
J21  0826-1X1T-M1-F  [BEL_0826-1X1T-M1-F]
J22  NPTC202KFMS-RC  [SULLINS_NPTC202KFMS-RC]
L40  value 420R@700MHz  Manufacturer: Murata  [IND_0201_UN1Q]  (hidden comment: FERRITE_0201_BLF_700MHz_420Ohm)
L41  value 33R@100MHz  Manufacturer: Murata  [IND_0201_UN1Q]  (hidden comment: FERRITE_0201_BLM03_33Ohm)
N1  Manufacturer: Texas Instruments  [X2SON_DPW0005B]  (hidden comment: TMP110DIDPWR)
PTP102  PTP_0.4mm  [PTP_0.4mm]  (value not drawn)  (no BOM)
PTP103  PTP_0.4mm  [PTP_0.4mm]  (value not drawn)  (no BOM)
PTP104  PTP_0.4mm  [PTP_0.4mm]  (value not drawn)  (no BOM)
R137  value 0R  [RES_0201_UN1Q]  (hidden comment: RES_0201_0R)
R138  value 1M  [RES_0201_UN1Q]  (hidden comment: RES_0201_1M)
T8  EMI_ESD_ECMF4-2450A60N10  [ECMF4-2450A60N10]  (value not drawn)
T9  EMI_ESD_ECMF4-2450A60N10  [ECMF4-2450A60N10]  (value not drawn)
U23  Manufacturer: NXP Semiconductors  [HX2QFN20_NXP]  (hidden comment: SE050E2HQ1/Z01Z3Z)
X2  GH-Connector_SM09B-GHS-TB  Manufacturer: JST  [SM09B-GHS-TB]

### Blocks framed on the sheet
TPM: C316 C317 L40 PTP102 PTP103 R138 U23
I2C address 0x40h: C318 L41 N1 PTP104

### Ports
EX_IO_3V3 (bidir, harness EX_IO), iMX8_ECSPI2 (bidir, harness iMX8_ECSPI2), iMX8_GPIO1 (bidir, harness iMX8_GPIO1), iMX8_I2C1 (bidir, harness iMX8_I2C1), iMX8_I2C2 (bidir, harness iMX8_I2C2), iMX8_I2C3 (bidir, harness iMX8_I2C3), iMX8_I2C4 (bidir, harness iMX8_I2C4), iMX8_UART1 (bidir, harness iMX8_UART1), iMX8_UART2 (bidir, harness iMX8_UART2), iMX8_UART3 (bidir, harness iMX8_UART3), iMX8_UART4 (bidir, harness iMX8_UART4), LAN1_CONN (bidir, harness LAN1_CONN), LAN2_CONN (bidir, harness LAN2_CONN), ~{GPIO_EXP_INT} (out), ~{PER_GPIO_INT} (out)

### Harnesses
LAN2_CONN: LAN2_LED0, LAN2_LED1, LAN2_LED2, *LAN2_TXRXA_P, *LAN2_TXRXA_N, *LAN2_TXRXB_P, *LAN2_TXRXB_N, *LAN2_TXRXC_P, *LAN2_TXRXC_N, *LAN2_TXRXD_P, *LAN2_TXRXD_N
LAN1_CONN: LAN1_LED0, LAN1_LED1, LAN1_LED2, *LAN1_TXRXA_P, *LAN1_TXRXA_N, *LAN1_TXRXB_P, *LAN1_TXRXB_N, *LAN1_TXRXC_P, *LAN1_TXRXC_N, *LAN1_TXRXD_P, *LAN1_TXRXD_N
iMX8_GPIO1: GPIO1_IO00, GPIO1_IO01, GPIO1_IO05, GPIO1_IO06, GPIO1_IO07, GPIO1_IO08, GPIO1_IO09, GPIO1_IO10, GPIO1_IO11, GPIO1_IO12, GPIO1_IO13, GPIO1_IO14, GPIO1_IO15
iMX8_UART1: UART1_RXD, UART1_TXD
iMX8_UART2: UART2_RXD, UART2_TXD
iMX8_UART3: UART3_RXD, UART3_TXD
iMX8_UART4: UART4_RXD, UART4_TXD
iMX8_I2C1: I2C1_SCL, I2C1_SDA
iMX8_I2C2: I2C2_SCL, I2C2_SDA
iMX8_I2C3: I2C3_SCL, I2C3_SDA
iMX8_I2C4: I2C4_SCL, I2C4_SDA
iMX8_ECSPI2: ECSPI2_SS0, ECSPI2_MOSI, ECSPI2_MISO, ECSPI2_SCLK
EX_IO: IO_P0_2, IO_P1_1, IO_P0_1, IO_P0_0, IO_P1_2, IO_P1_0

### Nets
3V3_SMPS: L41.2
5V0_SMPS: J20.11 J22.11
GND: C312.1 C313.1 C314.1 C315.1 C316.2 C317.1 C318.2 J20.3 J20.5 J20.7 J20.9 J20.19 J20.21 J20.23 J20.25 J20.27 J20.28 J20.30 J20.32 J20.34 J20.36 J20.38 J20.40 J21.S1(SHIELD) J21.S2(SHIELD) J22.3 J22.5 J22.7 J22.9 J22.15 J22.17 J22.19 J22.21 J22.23 J22.28 J22.30 J22.40 N1.1(GND) N1.3(ADD0) R137.2 T8.3(GND) T8.8(GND) T9.3(GND) T9.8(GND) U23.1(LB) U23.17(LA) U23.19(VSS) U23.21(EPAD) X2.MP1 X2.MP2
VDD_1V8: J20.13 J22.13
VDD_3V3: J20.1 J22.1 L40.2
**LAN2_TXRXA_N: T9.4(D2+) X2.7
**LAN2_TXRXA_P: T9.5(D2-) X2.8
**LAN2_TXRXB_N: T8.4(D2+) X2.3
**LAN2_TXRXB_P: T8.5(D2-) X2.6
**LAN2_TXRXC_N: T9.1(D1+) X2.4
**LAN2_TXRXC_P: T9.2(D1-) X2.5
**LAN2_TXRXD_N: T8.1(D1+) X2.1
**LAN2_TXRXD_P: T8.2(D1-) X2.2
*LAN1_TXRXA_N: J21.11(TRD1+) ; port LAN1_CONN.*LAN1_TXRXA_N
*LAN1_TXRXA_P: J21.10(TRD1-) ; port LAN1_CONN.*LAN1_TXRXA_P
*LAN1_TXRXB_N: J21.4(TRD2+) ; port LAN1_CONN.*LAN1_TXRXB_N
*LAN1_TXRXB_P: J21.5(TRD2-) ; port LAN1_CONN.*LAN1_TXRXB_P
*LAN1_TXRXC_N: J21.3(TRD3+) ; port LAN1_CONN.*LAN1_TXRXC_N
*LAN1_TXRXC_P: J21.2(TRD3-) ; port LAN1_CONN.*LAN1_TXRXC_P
*LAN1_TXRXD_N: J21.8(TRD4+) ; port LAN1_CONN.*LAN1_TXRXD_N
*LAN1_TXRXD_P: J21.9(TRD4-) ; port LAN1_CONN.*LAN1_TXRXD_P
*LAN2_TXRXA_N: T9.7(D2+_IC) ; port LAN2_CONN.*LAN2_TXRXA_N
*LAN2_TXRXA_P: T9.6(D2-_IC) ; port LAN2_CONN.*LAN2_TXRXA_P
*LAN2_TXRXB_N: T8.7(D2+_IC) ; port LAN2_CONN.*LAN2_TXRXB_N
*LAN2_TXRXB_P: T8.6(D2-_IC) ; port LAN2_CONN.*LAN2_TXRXB_P
*LAN2_TXRXC_N: T9.10(D1+_IC) ; port LAN2_CONN.*LAN2_TXRXC_N
*LAN2_TXRXC_P: T9.9(D1-_IC) ; port LAN2_CONN.*LAN2_TXRXC_P
*LAN2_TXRXD_N: T8.10(D1+_IC) ; port LAN2_CONN.*LAN2_TXRXD_N
*LAN2_TXRXD_P: T8.9(D1-_IC) ; port LAN2_CONN.*LAN2_TXRXD_P
~{GPIO_EXP_INT}: J20.4 ; port ~{GPIO_EXP_INT}, port iMX8_GPIO1.GPIO1_IO01
ECSPI2_MISO: J22.36 ; port iMX8_ECSPI2.ECSPI2_MISO
ECSPI2_MOSI: J22.34 ; port iMX8_ECSPI2.ECSPI2_MOSI
ECSPI2_SCLK: J22.38 ; port iMX8_ECSPI2.ECSPI2_SCLK
GPIO1_IO00: J20.2 ; port ~{PER_GPIO_INT}, port iMX8_GPIO1.GPIO1_IO00
GPIO1_IO05: J20.6 ; port iMX8_GPIO1.GPIO1_IO05
GPIO1_IO06: J20.8 ; port iMX8_GPIO1.GPIO1_IO06
GPIO1_IO07: J20.10 ; port iMX8_GPIO1.GPIO1_IO07
GPIO1_IO08: J20.12 ; port iMX8_GPIO1.GPIO1_IO08
GPIO1_IO09: J20.14 ; port iMX8_GPIO1.GPIO1_IO09
GPIO1_IO10: J20.16 ; port iMX8_GPIO1.GPIO1_IO10
GPIO1_IO11: J20.18 ; port iMX8_GPIO1.GPIO1_IO11
GPIO1_IO12: J20.20 ; port iMX8_GPIO1.GPIO1_IO12
GPIO1_IO13: J20.22 ; port iMX8_GPIO1.GPIO1_IO13
GPIO1_IO14: J20.24 ; port iMX8_GPIO1.GPIO1_IO14
GPIO1_IO15: J20.26 ; port iMX8_GPIO1.GPIO1_IO15
I2C1_SCL: J22.25 ; port iMX8_I2C1.I2C1_SCL
I2C1_SDA: J22.27 ; port iMX8_I2C1.I2C1_SDA
I2C2_SCL: J22.29 U23.10(SCL) ; port iMX8_I2C2.I2C2_SCL
I2C2_SDA: J22.31 U23.9(SDA) ; port iMX8_I2C2.I2C2_SDA
I2C3_SCL: J22.33 ; port iMX8_I2C3.I2C3_SCL
I2C3_SDA: J22.35 ; port iMX8_I2C3.I2C3_SDA
I2C4_SCL: J22.37 ; port iMX8_I2C4.I2C4_SCL  [project net ~{PCIE_CLK_REQ}]
I2C4_SDA: J22.39 ; port iMX8_I2C4.I2C4_SDA  [project net ~{PCIE_WAKE}]
I2C5_SCL: N1.2(SCL)
I2C5_SDA: N1.4(SDA)
IO_P0_1: J22.4 ; port EX_IO_3V3.IO_P0_1
IO_P0_2: J22.6 ; port EX_IO_3V3.IO_P0_2
IO_P1_0: J22.8 ; port EX_IO_3V3.IO_P1_0
IO_P1_1: J22.10 ; port EX_IO_3V3.IO_P1_1
IO_P1_2: J22.12 ; port EX_IO_3V3.IO_P1_2
POR_B_3V3: R138.2
SE050_VOUT: C317.2 U23.15(VOUT) U23.18(VCC)
TPM_ENA: J22.2 PTP103.1(TP) R138.1 U23.11(ENA) ; port EX_IO_3V3.IO_P0_0
UART1_RXD: J20.15 ; port iMX8_UART1.UART1_RXD
UART1_TXD: J20.17 ; port iMX8_UART1.UART1_TXD
UART2_RXD: J20.29 ; port iMX8_UART2.UART2_RXD
UART2_TXD: J20.31 ; port iMX8_UART2.UART2_TXD
UART3_RXD: J20.33 ; port iMX8_UART3.UART3_RXD
UART3_TXD: J20.35 ; port iMX8_UART3.UART3_TXD
UART4_RXD: J20.37 ; port iMX8_UART4.UART4_RXD
UART4_TXD: J20.39 ; port iMX8_UART4.UART4_TXD
NetC312_2: C312.2 J21.12(TRCT1)
NetC313_2: C313.2 J21.6(TRCT2)
NetC314_2: C314.2 J21.1(TRCT3)
NetC315_2: C315.2 J21.7(TRCT4)
NetC316_1: C316.1 L40.1 PTP102.1(TP) U23.12(VIN) U23.14(~{RST})
NetC318_1: C318.1 L41.1 N1.5(V+) PTP104.1(TP)
NetJ22_32: J22.32 ; port iMX8_ECSPI2.ECSPI2_SS0
NetR137_1: R137.1 X2.9

Not connected (* = marked no-connect by the designer): J21 13(VC1)* 14(VC2)* 15(VC3)* 16(VC4)* 17* 18* 19* 20*; J22 14 16 18 20 22 24 26; U23 2(nc)* 3(IO1)* 4(nc)* 5(nc)* 6(nc)* 7(nc)* 8(nc)* 13(CLK)* 16(IO2)* 20(nc)*

### Layout directives
differential pair; net class Ethernet; differential pair class 100; rule Matched Net Lengths [Tolerance = 0.4mm]: **LAN2_TXRXA_N, **LAN2_TXRXA_P, **LAN2_TXRXB_N, **LAN2_TXRXB_P, **LAN2_TXRXC_N, **LAN2_TXRXC_P, **LAN2_TXRXD_N, **LAN2_TXRXD_P, *LAN1_TXRXA_N, *LAN1_TXRXA_P, *LAN1_TXRXB_N, *LAN1_TXRXB_P, *LAN1_TXRXC_N, *LAN1_TXRXC_P, *LAN1_TXRXD_N, *LAN1_TXRXD_P, *LAN2_TXRXA_N, *LAN2_TXRXA_P, *LAN2_TXRXB_N, *LAN2_TXRXB_P, *LAN2_TXRXC_N, *LAN2_TXRXC_P, *LAN2_TXRXD_N, *LAN2_TXRXD_P
net class SEC: I2C2_SCL, I2C2_SDA

### Notes on the sheet
- Ethernet interface
- Eth1
- (near X2) Eth2
- Temperature sensor
- P0_0 = Open collector
- DWG NO:
- REV:
- THIS DOCUMENT AND THE DATA DISCLOSED HEREIN OR
- HEREWITH IS THE PROPERTY OF ALTIUM LIMITED AND MAY
- BE FREELY DISTRIBUTED IN WHOLE. NO RIGHTS ARE
- RESERVED OR EXPRESS OR IMPLIED WARANTEE GIVEN.
- REVISION
- DESCRIPTION
- DATE
- APPROVED
- ENG:
- APPROVALS
- PROJECT
- DSN:
- CHK:
- REFERENCE DOCUMENTS
- PROJECT REVISION:
- TITLE
- DOCUMENT REVISION:
- DESIGN ITEM:
- BOM:
- FAB DWG:
- PCB DWG:
- ASSY DWG:
- SCALE:
- A2
- SIZE
- CAGE CODE
- FILE NAME
- DWG NO.
- SHEET
- OF
- REV
- (in symbol 0826-1X1T-M1-F) YLW; ORG; GRN

### Library data of the parts
C312-C318 = CMP-001-000385-16: as C250 on sheet USB_PER2; Package: 0201; ClassName: SMALL; ComponentLink1Description: 1_Datasheet; ComponentLink2Description: 2_Product page; ComponentLink3Description: 3_X-information; ComponentLink4Description: 4_X-information; Creation date: 20190101; Source: RLC_UN1Q.SchLib; Manufacturer Part Number: GRM033C71C104KE14D; Component Type: Capacitor
J20 J22 = NPTC202KFMS-RC: MF: {'manufacturer': u'Sullins Connector Solutions'}; Package: None; Price: None; Value: *; MP: NPTC202KFMS-RC; Availability: Unavailable
J21 = 0826-1X1T-M1-F: MagJack 1000BASE-T | PoE | 1X1 | OG/Y | Tab Up | RoHS; MF: Bel Magnetic Solutions; Package: None; MP: 0826-1X1T-M1-F; Availability: Unavailable; Price: None; Value: *; SnapEDA_Link: https://www.snapeda.com/parts/0826-1X1T-M1-F/Bel%20Magnetic%20Solutions/view-part/2753104/?ref=snap
L40 = CMP-001-000747-7: FERRITE; Part Number: BLF03JD421GZE; Manufacturer Part Number: BLF03JD421GZED; Tolerance: 25%; Sort order: 362; HasBeenBuilt: False; System: Discrete; Package: 0201; Operating temperature range: -55 ... +125C; ComponentLink1Description: 1_Datasheet; ComponentLink2Description: 2_Product page; ComponentLink3Description: 3_X-information; ComponentLink4Description: 4_X-information; Creation date: 20200304; ClassName: SMALL; Source: Discrete_UN1Q.SchLib; Component Type: Ferrite
L41 = CMP-001-000744-8: as L32 on sheet ETHERNET; Package: 0201; Operating temperature range: -55 ... +125C; ClassName: SMALL; ComponentLink1Description: 1_Datasheet; ComponentLink1URL: https://www.murata.com/en-us/products/productdetail.aspx?cate=luNoiseSupprFilteChipFerriBead&partno=BLM03PG330SN1%23; ComponentLink2Description: 2_Product page; ComponentLink3Description: 3_X-information; ComponentLink4Description: 4_X-information; Creation date: 20200304; Source: Discrete_UN1Q.SchLib; Component Type: Ferrite
N1 = CMP-001-001548-1: I2C temperature sensor, X2SON-5; Sort order: 445; System: IC; ComponentLink2Description: 2_Product page; ComponentLink3Description: 3_X-information; Part Number: TMP110DIDPWR; ComponentLink1URL: https://www.ti.com/lit/ds/symlink/tmp110.pdf; Creation date: 20250911; ComponentLink1Description: 1_Datasheet; ClassName: BIG; Package: X2SON-5; ComponentLink4Description: 4_X-information; Dimensions WxLxH: 0.8 × 0.8 × 0.4mm; Manufacturer Part Number: TMP110DIDPWR; Component Type: Sensor
PTP102-PTP104 = CMP-001-001296-3: as PTP92-PTP94 on sheet USB_PER2; ComponentLink4Description: 4_X-information; ComponentLink1Description: 1_Datasheet; Sort order: -; ClassName: SMALL; System: Test Point; HasBeenBuilt: -; Design Item ID: PTP_0.4mm; ComponentLink3Description: 3_X-information; Creation date: 20240909; ComponentLink2Description: 2_Product page; Component Type: Test Point
R137 = CMP-001-000429-13: RES; Part Number: RC0201JR-070RL; Manufacturer: YAGEO; Manufacturer: Yageo Group; Tolerance: 5%; Sort order: 322; HasBeenBuilt: TBD; Alternative component: Allowed; System: RLC; Power Rating: 1/20W; Package: 0201; ComponentLink1Description: 1_Datasheet; ComponentLink2Description: 2_Product page; ComponentLink3Description: 3_X-information; ComponentLink4Description: 4_X-information; Creation date: 20190101; ClassName: SMALL; Source: RLC_UN1Q.SchLib; Manufacturer Part Number: RC0201JR-070RL; Component Type: Resistor
R138 = CMP-001-000431-12: RES; Manufacturer: Yageo; Part Number: RC0201FR-071ML; Sort order: 322; System: RLC; Tolerance: 1%; HasBeenBuilt: TBD; Alternative component: Allowed; Power Rating: 1/20W; ComponentLink1Description: 1_Datasheet; ClassName: SMALL; ComponentLink2Description: 2_Product page; Creation date: 20190101; Package: 0201; ComponentLink4Description: 4_X-information; Source: RLC_UN1Q.SchLib; ComponentLink3Description: 3_X-information
T8 T9 = CMP-001-001620-1: EMI Filter with ESD, 2x differential pair; Manufacturer: STMicroelectronics; System: Discrete; Sort order: 441; ComponentLink3Description: 3_X-information; Operating temperature range: -55°C ~ 125°C; Part Number: ECMF4-2450A60N10; Package: 10-XFDFN; ComponentLink1URL: https://www.st.com/resource/en/datasheet/ecmf4-2450a60n10.pdf; ComponentLink2Description: 2_Product page; Creation date: 20251103; ComponentLink2URL: https://www.st.com/en/protections-and-emi-filters/common-mode-filters-with-integrated-esd-protection-ecmf.html; ComponentLink1Description: 1_Datasheet; ComponentLink4Description: 4_X-information; Dimensions WxLxH: 2.20 x 1.35 x 0.50mm; Manufacturer Part Number: ECMF4-2450A60N10; Component Type: ESD & EMI
U23 = CMP-001-001414-1: TPM; Manufacturer: NXP USA Inc.; Sort order: 501; System: IC; ComponentLink1Description: 1_Datasheet; ComponentLink1URL: https://www.nxp.com/part/SE050E2HQ1; ComponentLink2Description: 2_Product page; ComponentLink2URL: https://www.nxp.com/products/security-and-authentication/authentication/edgelock-se050-plug-trust-secure-element-family-enhanced-iot-security-with-high-flexibility:SE050; ComponentLink3Description: 3_X-information; ComponentLink3URL: https://www.nxp.com/docs/en/package-information/SOT1969-1.pdf; Creation date: 20250528; Dimensions WxLxH: 3 x 3 x  0.33mm; Operating temperature range: -40°C .... +105°C; Package: HX2QFN20; Part Number: SE050E2HQ1/Z01Z3Z; ComponentLink4Description: 4_X-information; ComponentLink4URL: https://www.nxp.com/products/SE050; Manufacturer Part Number: SE050E2HQ1/Z01Z3Z; Component Type: Integrated Circuit
X2 = CMP-001-000097-10: JST GH Connector, Header, 9 pin, Horizontal, Pitch 1.25 mm; Manufacturer Part Number: SM09B-GHS-TB(LF)(SN); Sort order: 111; HasBeenBuilt: False; Part Number: SM09B-GHS-TB; ClassName: BIG; Operating temperature range: -25 ... +85 °C; ComponentLink1Description: 1_Datasheet; ComponentLink1URL: https://www.jst-mfg.com/product/pdf/eng/eGH.pdf; ComponentLink2Description: 2_Product page; ComponentLink3Description: 3_X-information; ComponentLink4Description: 4_X-information; Creation date: 20210708; Dimensions WxLxH: 4.05x14.5x4.25; System: Connector; Design Item ID: GH-Connector_SM09B-GHS-TB; Source: Conn_UN1Q.SchLib; Component Type: Connector